# EAGLE design RscDroneBadge (EAGLE 9.6.2)
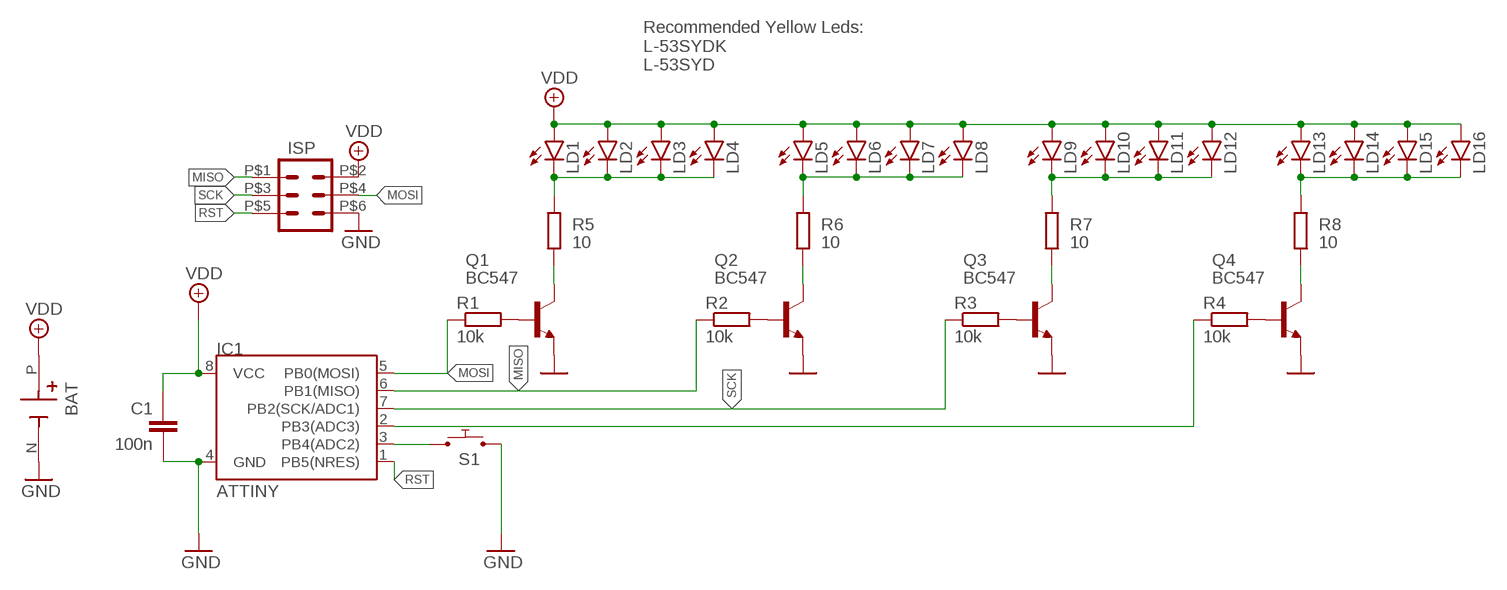
[diagram p0: schematic, sheet 1]

## Parts
BAT  CR2032 HOLDER  CR2032_PLASTIC  [CR2032_PLASTIC]
C1  100n  CAPACITOR_THT_2.54  [C_2.54]
IC1  ATTINY  ATTINY85-20PU  [DIL08]
ISP  2X3POGONO_VIA  [2X3_POGO_NO_VIA]
LD1  LED_THT-5MM_NICE  [LED_5MM_NICE]
LD2  LED_THT-5MM_NICE  [LED_5MM_NICE]
LD3  LED_THT-5MM_NICE  [LED_5MM_NICE]
LD4  LED_THT-5MM_NICE  [LED_5MM_NICE]
LD5  LED_THT-5MM_NICE  [LED_5MM_NICE]
LD6  LED_THT-5MM_NICE  [LED_5MM_NICE]
LD7  LED_THT-5MM_NICE  [LED_5MM_NICE]
LD8  LED_THT-5MM_NICE  [LED_5MM_NICE]
LD9  LED_THT-5MM_NICE  [LED_5MM_NICE]
LD10  LED_THT-5MM_NICE  [LED_5MM_NICE]
LD11  LED_THT-5MM_NICE  [LED_5MM_NICE]
LD12  LED_THT-5MM_NICE  [LED_5MM_NICE]
LD13  LED_THT-5MM_NICE  [LED_5MM_NICE]
LD14  LED_THT-5MM_NICE  [LED_5MM_NICE]
LD15  LED_THT-5MM_NICE  [LED_5MM_NICE]
LD16  LED_THT-5MM_NICE  [LED_5MM_NICE]
Q1  BC547  [TO92_ROUND]
Q2  BC547  [TO92_ROUND]
Q3  BC547  [TO92_ROUND]
Q4  BC547  [TO92_ROUND]
R1  10k  RESISTOR_0207_THT0204/7_ROUND  [RCL_0207]
R2  10k  RESISTOR_0207_THT0204/7_ROUND  [RCL_0207]
R3  10k  RESISTOR_0207_THT0204/7_ROUND  [RCL_0207]
R4  10k  RESISTOR_0207_THT0204/7_ROUND  [RCL_0207]
R5  10  RESISTOR_0207_THT0204/7_ROUND  [RCL_0207]
R6  10  RESISTOR_0207_THT0204/7_ROUND  [RCL_0207]
R7  10  RESISTOR_0207_THT0204/7_ROUND  [RCL_0207]
R8  10  RESISTOR_0207_THT0204/7_ROUND  [RCL_0207]
S1  6x6mm BUTTON  PUSH_MOMENTARY_THT_6X6MM  [TACTILE-PTH]

## Nets
GND: BAT.N(NEG) C1.2 IC1.4(GND) ISP.P$6 Q1.1(E) Q2.1(E) Q3.1(E) Q4.1(E) S1.3 S1.4
MISO: IC1.6(PB1(MISO)) ISP.P$1 R2.1
MOSI: IC1.5(PB0(MOSI)) ISP.P$4 R1.1
N$1: IC1.3(PB4(ADC2)) S1.1 S1.2
N$2: Q1.2(B) R1.2
N$3: Q2.2(B) R2.2
N$4: Q3.2(B) R3.2
N$8: Q4.2(B) R4.2
N$9: IC1.2(PB3(ADC3)) R4.1
N$10: Q1.3(C) R5.1
N$11: Q2.3(C) R6.1
N$12: Q3.3(C) R7.1
N$13: Q4.3(C) R8.1
N$14: LD9.K(C) LD10.K(C) LD11.K(C) LD12.K(C) R7.2
N$15: LD13.K(C) LD14.K(C) LD15.K(C) LD16.K(C) R8.2
N$19: LD5.K(C) LD6.K(C) LD7.K(C) LD8.K(C) R6.2
N$20: LD1.K(C) LD2.K(C) LD3.K(C) LD4.K(C) R5.2
RST: IC1.1(PB5(NRES)) ISP.P$5
SCK: IC1.7(PB2(SCK/ADC1)) ISP.P$3 R3.1
VDD: BAT.P(POS) C1.1 IC1.8(VCC) ISP.P$2 LD1.A LD2.A LD3.A LD4.A LD5.A LD6.A LD7.A LD8.A LD9.A LD10.A LD11.A LD12.A LD13.A LD14.A LD15.A LD16.A

## Notes on the sheet
- Recommended Yellow Leds:
  L-53SYDK
  L-53SYD

## Library data of the parts
BAT = BASTL_BATHOLDER:CR2032_PLASTIC: DS1092-04-B6P BH-25F-1
C1 = BASTL_CAPACITORS:CAPACITOR_THT: CAPACITOR, European symbol
IC1 = BASTL_ICS:ATTINY85: Atmel 8-pin 2/4/8kB flash uC; TYPE: THT
ISP = BASTL_CONNECTORS:2X3POGO; TYPE: POGO
LD1-LD16 = BASTL_LEDS:LED_THT: [color]_[diameter]_[difused/clear] R_3mm_D
Q1-Q4 = BASTL_TRANZISTORS:BC547
R1-R8 = BASTL_RESISTORS:RESISTOR_0207_THT: RESISTOR, European symbol
S1 = BASTL_SWITCHES:PUSH_MOMENTARY: Various NO switches- pushbuttons, reed, etc THT: TL1105SPF100Q SMT: TL3301SPF100QG, TL3301SPF160QG...; TYPE: THT

## Board
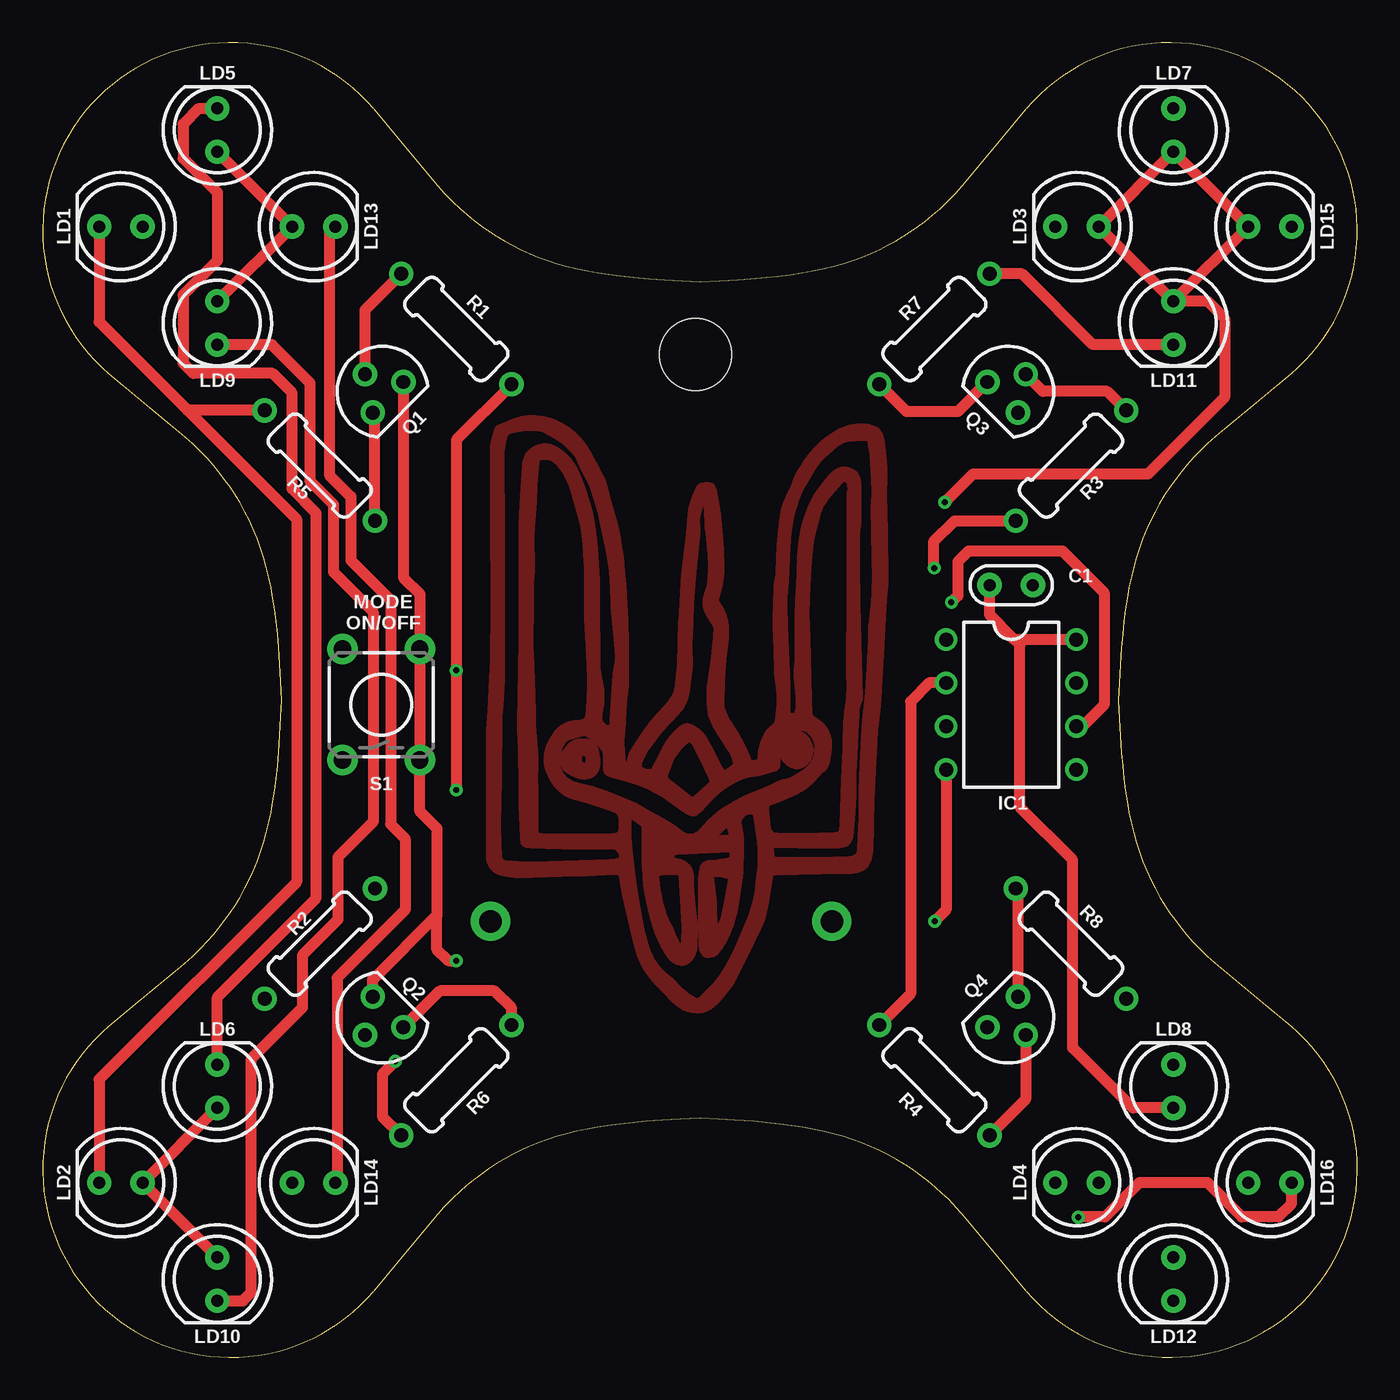
[diagram p1: board, top side]
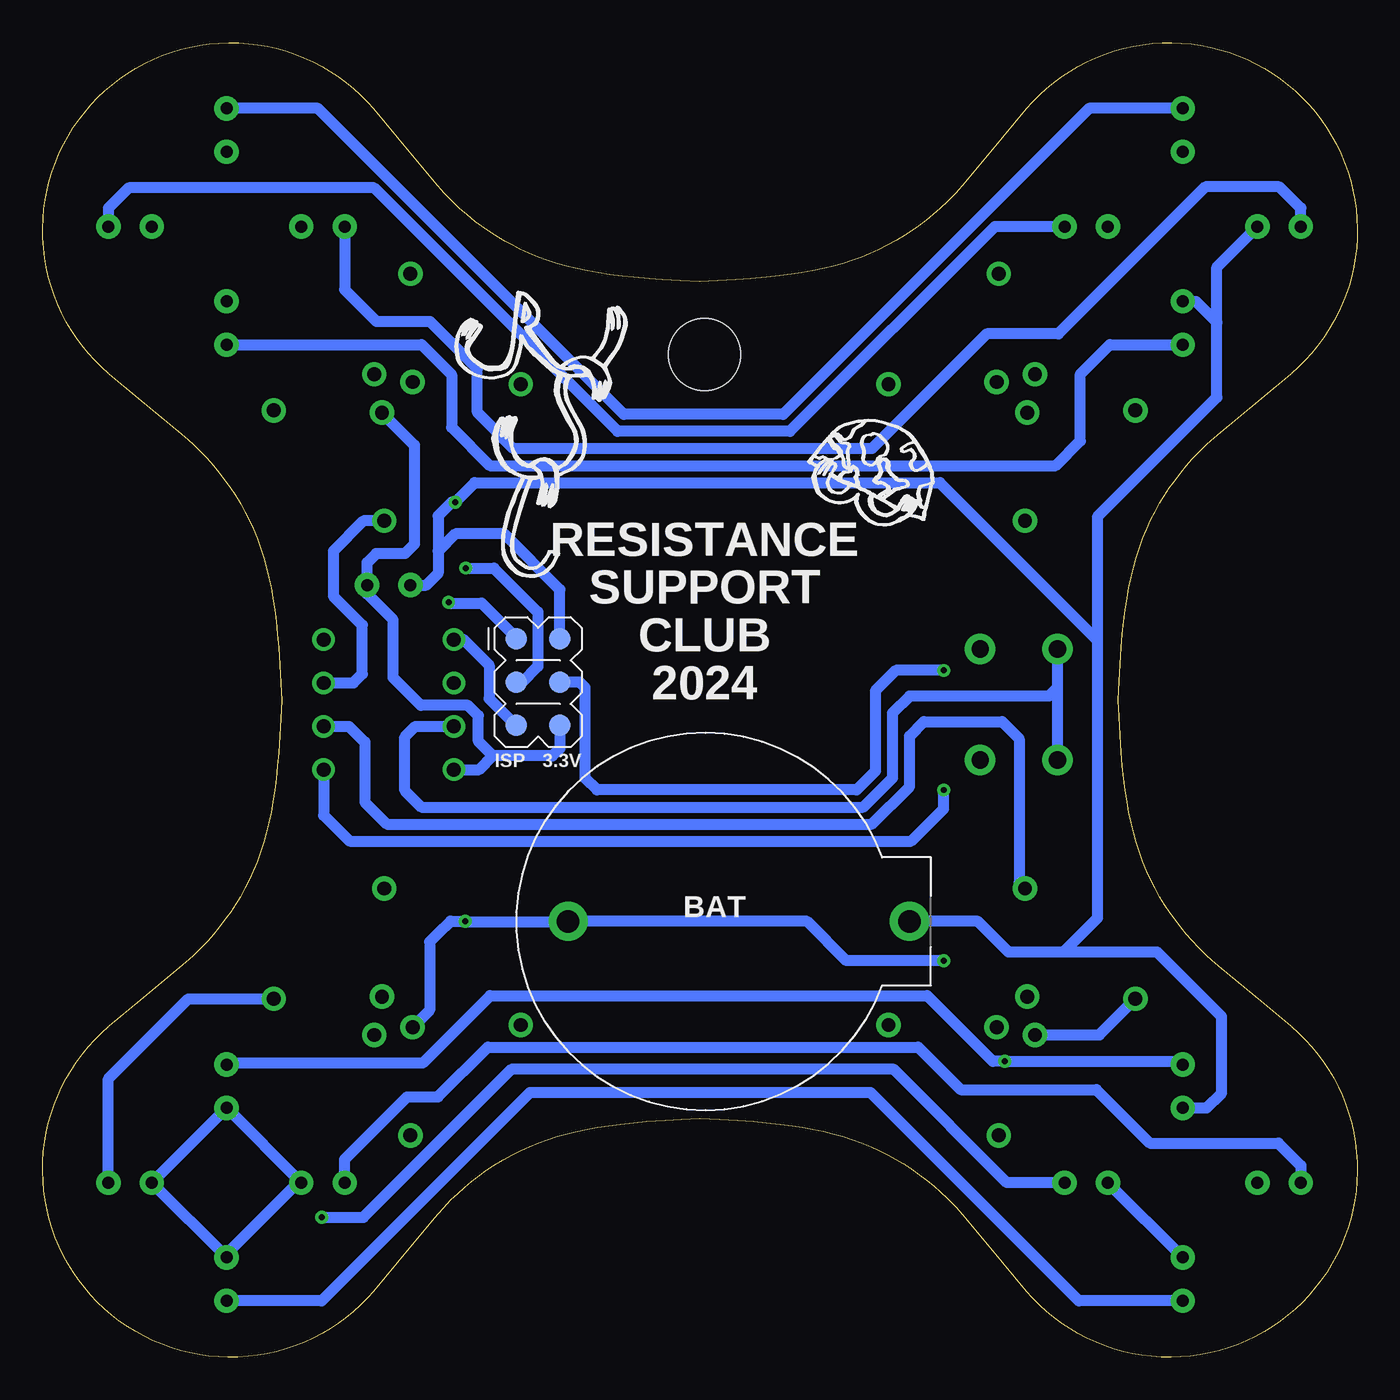
[diagram p2: board, bottom side, seen from below]

Size 77 x 77 mm. Coordinates in mm from the lower left corner, seen from the top.
Outline: 19.39,73.12 19.01,73.54 18.61,73.94 18.18,74.33 17.75,74.69 17.29,75.03 16.82,75.34 16.33,75.62 15.83,75.88 15.32,76.12 14.78,76.33 14.23,76.52 13.68,76.67 13.13,76.79 12.58,76.89 12,76.95 11.43,76.99 10.87,77 10.31,76.98 9.73,76.93 9.17,76.85 8.61,76.74 8.05,76.6 7.51,76.43 6.98,76.24 6.46,76.02 5.95,75.78 5.46,75.5 4.98,75.21 4.51,74.88 4.07,74.54 3.64,74.17 3.21,73.77 2.83,73.36 2.45,72.92 2.1,72.47 1.78,72.01 1.49,71.53 1.22,71.03 0.97,70.52 0.75,70 0.55,69.46 0.39,68.92 0.26,68.37 0.15,67.81 0.07,67.25 0.02,66.69 0,66.11 0.01,65.55 0.05,64.98 0.11,64.42 0.21,63.87 0.33,63.32 0.48,62.77 0.67,62.22 0.87,61.69 1.11,61.18 1.37,60.68 1.66,60.18 1.98,59.71 2.31,59.25 2.68,58.8 3.06,58.39 3.46,57.99 3.88,57.61 5.61,56.16 8.17,54.05 8.78,53.51 9.28,53.02 9.66,52.62 10.01,52.23 10.34,51.82 10.68,51.38 11,50.92 11.3,50.46 11.56,50.04 11.84,49.53 12.09,49.05 12.34,48.5 12.56,47.98 12.76,47.43 12.95,46.83 13.1,46.28 13.25,45.68 13.37,45.06 13.48,44.45 13.58,43.79 13.67,43.11 13.75,42.34 13.82,41.58 13.89,40.6 13.95,39.61 14,38.5 13.96,37.53 13.89,36.42 13.82,35.43 13.75,34.66 13.67,33.89 13.58,33.21 13.48,32.54 13.37,31.94 13.25,31.31 13.1,30.71 12.95,30.17 12.76,29.57 12.56,29.02 12.33,28.46 12.11,27.98 11.84,27.46 11.56,26.96 11.26,26.47 10.96,26.02 10.68,25.62 10.34,25.18 10.02,24.79 9.68,24.4 9.28,23.98 8.81,23.52 8.51,23.25 8.13,22.91 5.45,20.7 3.88,19.39 3.46,19.01 3.06,18.61 2.68,18.2 2.3,17.73 1.97,17.29 1.67,16.84 1.39,16.37 1.12,15.83 0.89,15.34 0.67,14.8 0.5,14.28 0.34,13.72 0.21,13.15 0.12,12.61 0.05,12.03 0.01,11.43 0,10.85 0.02,10.31 0.07,9.73 0.15,9.19 0.26,8.61 0.39,8.08 0.56,7.53 0.75,7 0.98,6.46 1.22,5.95 1.49,5.47 1.8,4.96 2.14,4.48 2.48,4.04 2.85,3.61 3.24,3.2 3.64,2.83 4.06,2.46 4.53,2.1 4.99,1.78 5.46,1.5 5.98,1.21 6.47,0.97 7.01,0.75 7.53,0.56 8.08,0.39 8.61,0.26 9.19,0.15 9.78,0.07 10.34,0.02 10.91,0 11.49,0.01 12.07,0.05 12.61,0.12 13.18,0.22 13.72,0.34 14.24,0.49 14.8,0.67 15.3,0.87 15.85,1.12 16.35,1.39 16.82,1.66 17.29,1.98 17.74,2.31 18.19,2.68 18.61,3.06 19.01,3.46 19.39,3.88 20.8,5.57 22.95,8.17 23.49,8.78 24.02,9.32 24.43,9.71 24.81,10.04 25.21,10.37 25.66,10.71 26.12,11.03 26.58,11.33 27.05,11.61 27.5,11.86 28.02,12.12 28.46,12.33 29.07,12.57 29.57,12.76 30.14,12.94 30.73,13.1 31.26,13.23 31.9,13.37 32.49,13.47 33.1,13.57 33.78,13.66 34.61,13.75 35.35,13.81 36.28,13.88 37.34,13.95 38.5,14 39.61,13.95 40.53,13.9 41.65,13.81 42.39,13.75 43.16,13.66 43.84,13.58 44.51,13.47 45.1,13.37 45.8,13.22 46.28,13.1 46.86,12.94 47.43,12.76 47.93,12.57 48.5,12.34 48.98,12.12 49.5,11.86 50.01,11.58 50.52,11.26 51.01,10.94 51.41,10.65 51.86,10.31 52.28,9.96 52.7,9.59 53.06,9.24 53.55,8.74 54.05,8.17 56.19,5.57 57.61,3.88 57.99,3.46 58.39,3.06 58.8,2.68 59.27,2.3 59.71,1.97 60.16,1.67 60.65,1.38 61.16,1.12 61.66,0.89 62.2,0.67 62.72,0.5 63.28,0.34 63.85,0.21 64.39,0.12 64.97,0.05 65.56,0.01 66.15,0 66.69,0.02 67.27,0.07 67.81,0.15 68.39,0.26 68.92,0.39 69.47,0.56 70,0.75 70.54,0.98 71.05,1.22 71.53,1.49 72.02,1.79 72.5,2.13 72.95,2.47 73.39,2.85 73.8,3.24 74.17,3.64 74.54,4.06 74.9,4.53 75.22,4.99 75.5,5.46 75.79,5.98 76.03,6.47 76.25,7.01 76.44,7.53 76.61,8.08 76.74,8.61 76.85,9.19 76.93,9.76 76.98,10.32 77,10.89 76.99,11.49 76.95,12.03 76.88,12.61 76.78,13.18 76.66,13.72 76.51,14.26 76.33,14.8 76.13,15.3 75.88,15.85 75.61,16.35 75.33,16.82 75.02,17.29 74.69,17.74 74.32,18.19 73.94,18.61 73.54,19.01 73.12,19.39 71.29,20.92 68.83,22.95 68.21,23.5 67.72,23.98 67.34,24.38 66.98,24.79 66.66,25.18 66.32,25.62 66,26.08 65.7,26.53 65.44,26.96 65.16,27.46 64.89,27.98 64.66,28.5 64.44,29.02 64.24,29.57 64.05,30.17 63.9,30.71 63.75,31.31 63.62,31.94 63.52,32.54 63.42,33.21 63.33,33.89 63.25,34.66 63.18,35.42 63.11,36.4 63.05,37.39 63,38.5 63.04,39.47 63.1,40.56 63.18,41.55 63.25,42.34 63.33,43.11 63.41,43.79 63.52,44.45 63.62,45.06 63.75,45.67 63.9,46.28 64.05,46.83 64.24,47.43 64.44,47.98 64.67,48.53 64.89,49.02 65.16,49.53 65.4,49.98 65.73,50.52 66.04,50.98 66.32,51.38 66.65,51.82 67.01,52.25 67.39,52.68 67.72,53.02 68.18,53.48 68.48,53.75 68.87,54.08 71.39,56.16 73.12,57.61 73.54,57.99 73.94,58.39 74.32,58.8 74.7,59.27 75.02,59.71 75.33,60.16 75.61,60.63 75.88,61.16 76.12,61.68 76.33,62.2 76.5,62.72 76.66,63.28 76.79,63.85 76.88,64.39 76.95,64.97 76.99,65.56 77,66.15 76.98,66.69 76.93,67.27 76.85,67.81 76.74,68.38 76.61,68.92 76.44,69.47 76.25,70 76.02,70.54 75.77,71.05 75.51,71.53 75.2,72.04 74.86,72.51 74.52,72.96 74.15,73.39 73.76,73.8 73.36,74.17 72.93,74.54 72.47,74.9 72.01,75.22 71.54,75.5 71.02,75.79 70.52,76.03 69.99,76.25 69.47,76.44 68.92,76.61 68.38,76.74 67.81,76.85 67.24,76.93 66.69,76.98 66.11,77 65.51,76.99 64.93,76.95 64.39,76.88 63.81,76.78 63.28,76.66 62.75,76.51 62.2,76.33 61.69,76.13 61.15,75.88 60.65,75.61 60.18,75.34 59.71,75.02 59.25,74.69 58.8,74.32 58.39,73.94 57.99,73.54 57.61,73.12 56.19,71.43 54.05,68.83 53.48,68.18 52.98,67.68 52.56,67.28 52.13,66.91 51.65,66.52 51.27,66.24 50.82,65.93 50.39,65.65 49.94,65.38 49.47,65.12 49.05,64.91 48.53,64.67 47.98,64.44 47.47,64.25 46.86,64.06 46.32,63.91 45.8,63.78 45.1,63.63 44.45,63.52 43.79,63.42 43.06,63.32 42.39,63.25 41.48,63.17 40.7,63.11 39.66,63.05 38.5,63 37.46,63.05 36.4,63.11 35.52,63.17 34.61,63.25 33.84,63.33 33.15,63.42 32.54,63.52 31.9,63.63 31.19,63.78 30.68,63.91 30.14,64.06 29.57,64.24 29.04,64.44 28.55,64.64 28.03,64.87 27.53,65.12 27.03,65.4 26.61,65.65 26.18,65.93 25.73,66.24 25.25,66.6 24.87,66.91 24.43,67.29 24,67.69 23.52,68.18 22.95,68.83 20.8,71.43 19.39,73.12
Copper layers (1*16): Top 0.035mm / dielectric 1.5mm / Bottom 0.035mm
Design rules "default_tenting_vias": minimum track width 6mil, minimum drill 0.35mm, track to track 6mil, track to pad 6mil, pad to pad 6mil, via to via 6mil, smd to smd 6mil, copper to edge 20mil, drill to drill 6mil, minimum pad ring 10mil, minimum via ring 8mil, stop-mask expansion 4mil, vias tented up to drill 15mil, thermal gap 10mil
Holes 4.2 mm at 38.23,58.73

### Footprints (pad centres in the part's own frame; a part is rotated, then mirrored left to right if it is on the bottom)
CR2032_PLASTIC = drill 1.3 pad 2.286: N -8,0; P 12,0
C_2.54 = drill 0.7 pad 1.422: 1 -1.27,0; 2 1.27,0
DIL08 = drill 0.813 pad 1.27: 1 -3.81,-3.81; 2 -1.27,-3.81; 3 1.27,-3.81; 4 3.81,-3.81; 5 3.81,3.81; 6 1.27,3.81; 7 -1.27,3.81; 8 -3.81,3.81
2X3_POGO_NO_VIA = smd 1.27 x 1.27: P$1 0,0; P$2 0,2.54; P$3 2.54,0; P$4 2.54,2.54; P$5 5.08,0; P$6 5.08,2.54
LED_5MM_NICE = drill 0.7 pad 1.422: A -1.27,0; K 1.27,0
TO92_ROUND = drill 0.813 pad 1.422: 1 1.27,0; 2 0,1.905; 3 -1.27,0
RCL_0207 = drill 0.813 pad 1.422: 1 -4.572,0; 2 4.572,0
TACTILE-PTH = drill 1.016 pad 1.778: 1 -3.251,2.261; 2 3.251,2.261; 3 -3.251,-2.261; 4 3.251,-2.261

### Placement (x,y rotation side)
BAT  38.23,25.53 0 bottom
C1  56.73,45.23 0 top
IC1  56.73,38.23 270 top
ISP  49.25,42.09 270 bottom
LD1  4.58,66.23 180 top
LD2  4.58,10.23 180 top
LD3  60.58,66.23 180 top
LD4  60.58,10.23 180 top
LD5  10.23,71.88 90 top
LD6  10.23,15.88 90 top
LD7  66.23,71.88 90 top
LD8  66.23,15.88 90 top
LD9  10.23,60.58 270 top
LD10  10.23,4.58 270 top
LD11  66.23,60.58 270 top
LD12  66.23,4.58 270 top
LD13  15.88,66.23 0 top
LD14  15.88,10.23 0 top
LD15  71.88,66.23 0 top
LD16  71.88,10.23 0 top
Q1  20.23,56.23 45 top
Q2  20.23,20.23 135 top
Q3  56.23,56.23 315 top
Q4  56.23,20.23 225 top
R1  24.23,60.23 135 top
R2  16.23,24.23 225 top
R3  60.23,52.23 45 top
R4  52.23,16.23 315 top
R5  16.23,52.23 135 top
R6  24.23,16.23 225 top
R7  52.23,60.23 45 top
R8  60.23,24.23 315 top
S1  19.83,38.23 90 top

### Tracks (layer width: path | path; a pad name or v marks a point on that pad's centre or on a via)
GND  (via drill 0.35)
  Top 0.635: Q1.1 21.13,45.67 22.09,44.71 S1.4 S1.3 22.09,31.98 23.09,30.98 23.09,25.89 | Q2.1 19.33,22.13 23.09,25.89 | v24.23,23.23 23.75,23.23 23.09,23.89 23.09,25.89 | IC1.4 52.92,26.22 v52.25,25.55
  Bottom 0.635: Q3.1 55.23,53.43 55.23,47.63 55.79,47.07 57.47,47.07 58,46.54 C1.2 58,44.72 56.47,43.19 56.47,39.81 54.85,38.19 52.09,38.19 51.48,37.58 51.48,36.08 50.63,35.23 | v24.23,23.23 29.93,23.23 32.23,25.53 BAT.N 52.22,25.52 v52.25,25.55 53.11,25.55 53.83,24.83 54.33,24.33 54.33,20.33 Q4.1 | ISP.P$6 46.71,35.66 47.14,35.23 50.63,35.23 | IC1.4 51.44,34.42 50.63,35.23
GND1
  pour Top (rank 3): 49.48,48.42 49.45,50.52 49.48,51.61 49.47,52.09 49.41,52.79 49.33,53.58 49.27,53.86 49.19,54.07 49.12,54.19 49.05,54.29 48.96,54.38 48.84,54.46 48.72,54.53 48.59,54.58 48.43,54.61 48.24,54.64 48.05,54.66 47.84,54.66 47.64,54.65 47.45,54.62 47.26,54.58 47.06,54.52 46.86,54.45 46.68,54.37 46.43,54.24 46.16,54.08 45.9,53.89 45.64,53.68 45.39,53.46 45.16,53.22 44.94,52.96 44.74,52.7 44.56,52.45 44.4,52.2 44.2,51.89 44.09,51.69 44,51.48 43.75,50.86 44.49,50.69 44.69,51.08 45.32,52.12 45.44,52.3 45.58,52.48 45.77,52.68 46,52.91 46.27,53.14 46.57,53.38 46.73,53.49 46.89,53.57 47.03,53.63 47.19,53.66 47.3,53.67 47.59,53.67 48.16,53.73 48.24,53.73 48.28,53.72 48.31,53.68 48.33,53.61 48.37,53.35 48.44,52.91 48.51,51.86 48.55,50.78 48.55,50.59 48.52,50.1 48.51,49.83 48.56,46.83 48.57,45.67 48.57,45.05 48.56,44.75 48.53,44.33 48.46,43.73 48.46,43.72 48.4,43.19 48.37,42.84 48.35,41.96 48.21,39.35 48.17,38.91 48.01,37.31 47.95,36.49 47.91,35.8 47.86,34.71 47.81,33.12 47.8,32.68 47.8,31.94 47.8,31.61 47.72,29.83 47.71,29.69 47.68,29.58 47.65,29.52 47.62,29.48 47.58,29.44 47.52,29.4 47.41,29.36 47.23,29.33 46.3,29.29 43.02,29.27 42.92,29.29 42.88,29.32 42.86,29.37 42.82,29.72 42.81,29.86 43,29.87 44.24,29.86 46.42,29.85 46.65,29.86 46.81,29.87 46.95,29.9 47.07,29.94 47.17,30 47.25,30.07 47.33,30.15 47.39,30.25 47.44,30.37 47.47,30.5 47.59,31.89 47.65,32.91 47.66,33.33 47.66,34.29 47.67,34.66 47.7,35.24 47.78,36.59 47.81,37.67 47.83,37.88 47.87,38.05 47.92,38.24 48.01,38.45 48.03,38.52 48.03,38.61 47.89,44.11 47.85,46.42 47.85,47.92 47.87,48.15 47.92,48.71 47.94,48.96 47.94,51.21 47.92,51.35 47.9,51.47 47.85,51.59 47.79,51.7 47.72,51.8 47.63,51.88 47.54,51.96 47.41,52.03 47.22,52.1 47.11,52.13 47.01,52.14 46.9,52.14 46.81,52.13 46.71,52.11 46.61,52.07 46.45,51.99 46.31,51.89 46.08,51.65 45.84,51.39 45.59,51.09 45.36,50.78 45.17,50.48 45,50.17 44.81,49.79 44.68,49.47 44.55,49.06 44.44,48.65 44.37,48.34 44.31,48 44.26,47.65 44.22,47.3 44.19,46.86 44.16,45.85 44.07,44.27 44.05,43.46 44.06,41.96 44.05,41.32 44.04,40.83 44,40.16 43.99,39.95 44.01,39.56 44.1,38.68 44.12,38.33 44.1,38.05 44.05,37.77 44.04,37.74 44.01,37.71 43.98,37.7 43.93,37.69 43.86,37.69 43.79,37.7 43.78,37.71 43.78,37.74 43.77,39.42 43.64,42.75 43.6,44.14 43.62,44.51 43.7,45.42 43.78,47.43 43.81,47.86 43.85,48.26 43.93,48.8 44.03,49.32 44.15,49.8 44.31,50.25 44.49,50.69 43.75,50.86 43.68,50.71 43.54,50.47 43.45,50.28 43.36,50.05 43.29,49.81 43.23,49.53 43.17,49.2 43.07,48.45 43.04,48.15 43,47.52 42.94,46.02 42.93,45.85 42.86,45.43 42.83,45.22 42.78,44.09 42.77,43.44 42.77,42.77 42.79,42.2 42.83,41.36 42.84,40.26 42.86,40 42.88,39.77 42.98,39.15 43,38.78 43,38.51 42.98,38.21 42.91,37.39 42.87,37.23 42.84,37.15 42.8,37.09 42.77,37.05 42.55,36.87 42.38,36.69 42.23,36.47 42.11,36.24 42.02,36.01 41.96,35.75 41.92,35.51 41.89,35.12 41.86,35 41.84,34.97 41.79,34.96 41.54,34.94 41.53,34.94 41.5,34.97 41.4,35.25 41.3,35.5 41.18,35.77 41.03,36.05 40.8,36.47 40.23,37.38 40.12,37.58 40.05,37.72 39.99,37.87 39.96,38.01 39.93,38.15 39.92,38.36 39.96,39.45 39.98,40.1 40.05,40.93 40.17,42.07 40.19,42.37 40.19,42.63 40.17,42.86 40.14,43.07 40.1,43.28 40.04,43.48 39.96,43.68 39.88,43.85 39.78,44.02 39.64,44.22 39.62,44.27 39.61,44.34 39.61,44.41 39.63,44.5 39.78,45.01 39.83,45.25 39.87,45.49 39.9,45.74 39.92,45.96 39.93,46.21 39.93,46.46 39.9,47.16 39.86,47.81 39.82,48.43 39.76,49.1 39.72,49.43 39.66,49.8 39.48,50.77 39.43,50.94 39.36,51.06 39.31,51.11 39.25,51.15 39.14,51.2 39,51.22 38.77,51.21 38.65,51.2 38.5,51.15 38.42,51.11 38.37,51.07 38.3,50.99 38.24,50.9 38.04,50.43 37.94,50.16 37.89,49.98 37.84,49.81 37.78,49.39 38.52,49.23 38.55,49.42 38.71,49.98 38.77,48.94 38.79,48.62 38.78,48.6 38.83,48.28 38.95,47.02 38.98,46.47 38.98,46.09 38.97,45.7 38.92,45.35 38.88,45.16 38.84,44.99 38.79,44.82 38.71,44.61 38.68,44.5 38.65,44.33 38.65,44.15 38.67,44.03 38.69,43.91 38.73,43.78 38.79,43.64 38.93,43.36 39.23,42.9 39.28,42.79 39.3,42.69 39.29,42.19 39.23,41.6 39.16,41.04 38.97,39.8 38.91,39.22 38.89,38.9 38.88,38.59 38.89,38.3 38.91,38.01 38.94,37.8 38.99,37.59 39.06,37.37 39.15,37.16 39.26,36.96 39.39,36.73 39.96,35.85 40.17,35.49 40.29,35.25 40.38,35.02 40.43,34.85 40.43,34.8 40.43,34.75 40.4,34.68 40.35,34.63 40.12,34.47 39.94,34.37 39.9,34.42 39.84,34.51 39.12,35.89 38.89,36.29 38.78,36.45 38.68,36.57 38.55,36.69 37.96,35.99 38.01,35.94 38.08,35.82 38.45,35.1 39.02,33.92 39.07,33.74 39.07,33.73 39.03,33.65 39.61,33.03 39.79,33.18 40.07,33.39 40.3,33.54 40.52,33.67 40.85,33.83 41.17,33.94 41.42,34 41.84,34.07 42.13,34.13 42.61,34.27 42.95,34.37 43.01,34.4 43.06,34.44 43.12,34.51 43.16,34.59 43.19,34.69 43.21,34.83 43.2,35.17 43.27,35.05 43.34,34.95 43.42,34.85 43.51,34.77 43.6,34.69 43.71,34.62 43.82,34.56 43.91,34.52 44.02,34.49 44.1,34.48 44.19,34.48 44.3,34.49 44.4,34.51 44.5,34.55 44.59,34.6 44.68,34.66 44.78,34.74 44.86,34.82 44.95,34.94 45.01,35.04 45.06,35.15 45.11,35.29 45.14,35.41 45.15,35.55 45.15,35.64 45.14,35.74 45.11,35.84 45.07,35.94 45.02,36.05 44.96,36.16 44.89,36.26 44.81,36.36 44.72,36.44 44.64,36.51 44.55,36.57 44.47,36.61 44.39,36.64 44.3,36.66 44.13,36.65 44.03,36.62 43.93,36.59 43.81,36.53 43.71,36.47 43.52,36.31 43.42,36.21 43.34,36.12 43.47,36.29 43.56,36.38 43.64,36.45 43.83,36.57 44.04,36.66 44.16,36.69 44.26,36.71 44.39,36.72 44.49,36.72 44.65,36.68 44.73,36.64 44.8,36.59 44.88,36.52 44.95,36.44 45.02,36.34 45.08,36.24 45.14,36.13 45.17,36.03 45.2,35.92 45.21,35.82 45.21,35.64 45.2,35.48 45.18,35.33 45.14,35.19 45.1,35.06 45.04,34.93 44.97,34.81 44.89,34.69 45.57,34.16 45.65,34.26 45.78,34.34 45.89,34.43 45.95,34.51 46.02,34.62 46.06,34.74 46.09,34.85 46.19,35.45 46.21,35.64 46.22,35.83 46.22,36.01 46.2,36.18 46.17,36.34 46.13,36.49 46.07,36.62 46.01,36.75 45.93,36.87 45.84,36.98 45.72,37.11 45.59,37.22 45.42,37.35 45.21,37.48 45.16,37.52 45.1,37.61 45.07,37.73 45.06,38.56 44.96,42.14 44.91,43.58 44.92,44.38 44.95,45.2 45.05,46.66 45.11,47.28 45.16,47.73 45.2,47.94 45.25,48.18 45.39,48.77 45.45,48.93 45.5,49.21 45.56,49.43 45.65,49.65 45.76,49.87 45.9,50.09 46.05,50.31 46.6,50.97 46.76,51.16 46.84,51.23 46.9,51.27 46.96,51.3 47.01,51.3 47.04,51.29 47.07,51.26 47.11,51.17 47.14,51.04 47.15,50.89 47.14,50.71 47.09,50.71 47.09,44.69 47.08,40.23 47.08,39.14 47.07,38.87 47.06,38.61 46.94,37.79 46.89,37.17 46.88,36.84 46.87,36.2 46.86,35.64 46.77,33.84 46.68,31.18 46.65,30.91 46.62,30.82 46.57,30.76 46.49,30.73 46.38,30.71 44.59,30.68 43.32,30.66 43.17,30.67 43.02,30.68 42.91,30.7 42.83,30.74 42.76,30.79 42.71,30.84 42.68,30.92 42.65,31.02 42.63,31.18 42.63,31.19 42.53,32.17 42.54,32.26 42.55,32.29 42.57,32.32 42.64,32.36 42.91,32.45 43.19,32.56 44.14,32.99 44.45,33.15 44.69,33.3 44.87,33.44 45.06,33.62 45.57,34.16 44.89,34.69 44.76,34.57 44.63,34.46 44.08,34.09 43.89,33.98 43.76,33.92 43.64,33.88 43.54,33.86 43.35,33.83 43.19,33.78 43.03,33.71 42.65,33.49 42.03,33.24 42,33.23 41.43,33 41.03,32.82 40.53,32.56 40.1,32.31 39.84,32.15 39.63,32 39.42,31.84 39.24,31.7 38.98,31.46 38.51,30.93 38.39,30.82 38.31,30.76 38.19,30.69 38.05,30.65 37.91,30.64 37.77,30.65 37.64,30.69 37.51,30.75 37.03,31.14 36.77,31.32 36.34,31.56 35.38,32.06 34.95,32.33 34.78,32.42 33.54,32.94 33,33.15 32.56,33.32 32.25,33.41 31.48,33.59 31.17,33.68 31.03,33.74 30.89,33.81 30.77,33.9 30.67,33.99 30.6,34.07 30.52,34.16 30.42,34.35 30.38,34.45 30.34,34.57 30.31,34.79 30.36,34.65 30.44,34.51 30.54,34.39 30.66,34.28 30.8,34.18 30.96,34.09 31.23,33.98 31.4,33.92 31.55,33.89 31.71,33.87 31.87,33.88 32.01,33.91 32.14,33.95 32.26,34.02 32.36,34.1 32.46,34.2 32.52,34.29 32.56,34.39 32.6,34.48 32.63,34.59 32.65,34.69 32.66,34.81 32.66,35.06 32.64,35.18 32.6,35.34 31.79,35.13 31.8,35.04 31.8,34.85 31.79,34.81 31.78,34.8 31.71,34.8 31.66,34.81 31.63,34.83 31.6,34.87 31.58,34.94 31.57,35.01 31.57,35.15 31.58,35.24 31.59,35.25 31.64,35.26 31.71,35.25 31.75,35.24 31.78,35.2 31.79,35.13 32.6,35.34 32.57,35.55 32.52,35.73 32.47,35.84 32.41,35.93 32.33,36.01 32.25,36.07 32.17,36.11 32.07,36.15 31.97,36.17 31.86,36.19 31.65,36.19 31.44,36.21 31.32,36.2 31.2,36.17 31.12,36.14 31.02,36.09 30.85,35.97 30.75,35.87 30.66,35.77 30.36,35.38 30.37,35.45 30.42,35.59 30.56,35.91 30.64,36.04 30.73,36.13 30.81,36.17 30.89,36.2 31.72,36.43 31.76,36.43 32.2,36.13 32.4,35.97 32.5,35.87 32.6,35.76 32.7,35.62 32.76,35.53 32.81,35.42 32.83,35.26 32.82,34.63 32.84,34.4 32.86,34.31 32.89,34.23 32.94,34.17 32.99,34.13 33.1,34.07 33.24,34.01 34.21,33.74 34.77,33.57 35.17,33.42 35.51,33.28 35.88,33.08 36.3,32.82 36.67,32.58 37.49,31.99 37.72,31.83 37.83,31.78 37.93,31.74 38.03,31.71 38.12,31.71 38.19,31.73 38.27,31.76 38.35,31.8 38.43,31.86 38.58,31.99 39.26,32.71 39.61,33.03 39.03,33.65 38.95,33.58 38.11,32.8 38.08,32.78 38.07,32.78 38.01,32.81 36.91,33.67 36.75,33.81 36.62,33.93 36.6,33.99 36.6,34.08 36.87,34.77 36.98,35 37.08,35.2 37.22,35.41 37.38,35.61 37.6,35.84 37.84,36.05 37.86,36.06 37.89,36.05 37.96,35.99 38.55,36.69 38.4,36.81 38.23,36.93 38.08,37.03 38,37.06 37.9,37.09 37.79,37.1 37.69,37.1 37.57,37.07 37.44,37.01 37.32,36.93 37.18,36.82 37.01,36.67 36.87,36.51 36.72,36.34 36.49,36.03 36.28,35.68 36.1,35.35 35.84,34.81 35.71,34.56 35.64,34.42 35.63,34.41 35.52,34.4 35.39,34.43 35.25,34.47 35.14,34.53 35.1,34.56 35.08,34.61 35.08,34.7 35.09,34.78 35.09,34.8 35.2,35.06 35.34,35.33 35.5,35.6 35.69,35.88 35.87,36.12 36.07,36.37 36.62,37.03 36.79,37.21 37.24,37.66 37.46,37.91 37.58,38.09 37.67,38.26 37.75,38.43 37.81,38.62 37.89,39.05 37.97,39.54 38.02,39.98 38.07,40.45 38.08,40.81 38.05,41.46 38.05,41.72 38.09,43.1 38.13,44.07 38.18,44.91 38.24,45.67 38.51,48.33 38.52,48.58 38.49,48.9 38.5,49.07 38.52,49.23 37.78,49.39 37.69,48.28 37.49,46.55 37.42,45.83 37.35,44.8 37.27,43.64 37.24,43.04 37.16,40.58 37.07,39.84 37.05,39.38 37.01,39.14 36.95,38.97 36.88,38.79 36.78,38.62 36.67,38.45 36.49,38.23 35.97,37.67 35.62,37.26 35.32,36.88 34.99,36.4 34.71,35.96 34.33,35.34 34.29,35.24 34.26,35.14 34.21,34.85 34.19,34.81 34.16,34.8 34.09,35.57 34.07,35.91 34.06,36.15 34.12,36.73 34.21,38.33 34.31,39.32 34.33,40.73 34.32,41.89 34.29,43.11 34.25,44.11 34.17,45.24 34.1,46.07 34.02,46.85 33.93,47.54 33.81,48.16 33.73,48.56 33.65,48.9 33.3,50.12 33.07,51.03 33.01,51.23 32.95,51.42 32.82,51.7 32.56,52.15 32.13,52.96 31.9,53.33 31.65,53.66 31.51,53.83 31.35,54 31.18,54.16 31.01,54.3 30.84,54.43 30.65,54.56 30.45,54.68 30.25,54.78 30.04,54.87 29.81,54.96 29.57,55.03 29.35,55.08 29.12,55.12 28.89,55.14 28.65,55.15 28.42,55.14 28.22,55.12 28.02,55.08 27.81,55.03 27.61,54.96 27.38,54.88 27.12,54.77 27.37,54.12 27.47,54.15 28.15,54.26 28.47,54.29 28.75,54.3 29.01,54.28 29.22,54.23 29.4,54.16 30,53.82 30.26,53.67 30.51,53.48 30.74,53.28 30.94,53.06 31.12,52.82 31.23,52.66 31.32,52.49 31.56,51.96 31.97,51.14 32.09,50.84 32.25,50.36 32.4,49.89 32.53,49.37 32.7,48.65 32.87,47.84 33,47.17 33.1,46.57 33.17,46.03 33.22,45.51 33.25,45.03 33.27,44.27 33.28,43.92 33.47,41.79 33.52,40.98 33.51,40.72 33.43,40.21 33.4,40 33.22,37.33 33.22,37.14 33.18,37 33.15,37 33.08,37.01 33.01,37.03 32.95,37.07 32.89,37.13 32.84,37.2 32.81,37.26 32.78,37.35 32.77,37.44 32.77,37.54 32.78,37.65 32.84,38.01 32.88,38.29 32.89,38.54 32.89,38.78 32.88,39.08 32.84,39.38 32.78,39.73 32.68,40.16 32.65,40.44 31.87,40.49 31.89,39.89 31.88,39.22 31.86,38.52 31.81,37.69 31.79,37.55 31.76,37.47 31.71,37.39 31.67,37.37 31.62,37.35 31.5,37.32 31.15,37.29 30.95,37.25 30.74,37.19 30.54,37.1 30.35,36.98 30.17,36.83 30,36.66 29.83,36.45 29.66,36.17 29.52,35.9 29.43,35.63 29.37,35.36 29.34,35.07 29.36,34.81 29.41,34.53 29.5,34.27 29.51,34.24 29.61,34.02 29.72,33.81 29.84,33.62 29.96,33.45 30.1,33.29 30.24,33.15 30.39,33.03 30.56,32.93 30.73,32.84 30.93,32.76 31.97,32.45 33.13,32.08 33.45,31.96 33.54,31.92 33.6,31.88 33.66,31.81 33.7,31.75 33.72,31.67 33.74,31.54 34.48,31.53 34.52,31.51 34.62,31.46 34.84,31.32 35.06,31.14 35.07,31.13 35.08,31.09 35.09,30.86 35.09,29.52 35.1,28.92 35.14,28.24 35.19,27.62 35.25,27.13 35.34,26.68 35.56,25.81 35.71,25.3 35.86,24.85 36.02,24.46 36.19,24.13 36.43,23.7 36.59,23.47 36.74,23.29 36.91,23.14 37.02,23.07 37.09,23.03 37.24,22.98 37.38,22.96 37.52,22.97 37.66,23 37.8,23.07 37.93,23.17 38.04,23.28 38.14,23.42 38.21,23.55 38.26,23.66 38.3,23.8 38.33,23.93 38.35,24.18 38.36,24.8 38.39,25.11 38.25,26.25 38.18,26.88 37.35,26.78 37.43,25.2 37.43,25.18 37.39,24.37 37.38,24.21 37.37,24.16 37.09,24.73 36.93,25.14 36.77,25.43 36.65,25.69 36.53,25.98 36.43,26.3 36.33,26.66 36.25,27.02 36.19,27.42 36.1,28.02 36.09,28.12 36.1,28.19 36.12,28.22 36.16,28.25 36.27,28.27 36.44,28.29 37.13,28.31 37.2,28.3 37.23,28.26 37.24,28.17 37.35,26.78 38.18,26.88 38.14,27.67 38.14,28.01 38.13,28.17 38.09,28.39 38.04,28.58 37.97,28.72 37.87,28.85 37.75,28.95 37.6,29.05 37.39,29.13 37.14,29.21 36.93,29.25 36.81,29.26 36.68,29.26 36.68,29.27 36.82,29.28 36.92,29.3 36.99,29.35 37.06,29.45 37.09,29.47 37.13,29.48 40.25,29.62 40.24,29.36 40.23,29.29 40.2,29.26 40.02,29.21 39.76,29.16 39.3,29.09 38.95,29.07 38.81,29.04 38.69,28.97 38.6,28.89 38.53,28.77 38.48,28.63 38.43,28.3 38.4,28.04 38.41,26.15 38.43,24.09 38.44,23.98 38.47,23.88 38.52,23.77 38.58,23.66 38.64,23.58 38.72,23.5 38.79,23.45 38.86,23.43 38.98,23.42 39.1,23.42 39.24,23.45 39.36,23.49 39.43,23.54 39.5,23.59 39.68,23.81 39.82,23.99 39.95,24.18 40.06,24.38 40.18,24.6 40.28,24.82 40.37,25.05 40.47,25.32 40.55,25.57 40.68,26.05 40.78,26.56 40.95,27.75 40.15,27.98 40.09,27.65 39.92,26.68 39.75,25.83 39.71,25.71 39.67,25.6 39.52,25.28 39.49,26.31 39.49,26.53 39.48,26.68 39.48,26.69 39.39,27.41 39.29,28.18 39.73,28.14 39.98,28.1 40.13,28.07 40.15,27.98 40.95,27.75 40.99,28.08 41.02,28.45 41.04,28.88 41.05,29.33 41.05,30.46 41.03,30.69 40.18,30.63 40.17,30.58 40.13,30.57 40.07,30.55 39.96,30.55 39.82,30.57 39.52,30.53 39.53,30.54 39.83,30.83 40.08,31.05 40.11,30.99 40.12,30.87 40.17,30.7 40.18,30.63 41.03,30.69 40.93,31.19 40.92,31.3 40.93,31.39 40.95,31.46 40.98,31.54 41.02,31.61 41.08,31.68 41.14,31.74 41.22,31.79 41.3,31.82 41.39,31.84 41.47,31.84 41.54,31.83 41.58,31.79 41.61,31.75 41.77,30.76 41.84,30.18 41.89,29.69 41.9,29.26 41.87,28.77 41.81,28.12 41.81,28.11 41.74,27.5 41.68,27.09 41.59,26.68 41.48,26.29 41.35,25.93 40.92,24.88 40.65,24.25 40.38,23.67 40.16,23.23 39.92,22.8 39.67,22.41 39.44,22.08 39.27,21.88 39.08,21.67 38.43,21.02 38.38,21 38.31,21 37.95,21.21 37.79,21.32 37.65,21.43 37.44,21.62 36.89,22.17 36.48,22.51 36.29,22.69 36.07,22.94 35.88,23.22 35.72,23.51 35.59,23.84 35.47,24.19 35.37,24.55 35.27,24.94 35.18,25.35 34.99,26.36 34.77,27.77 34.61,28.98 34.52,29.75 34.49,30.49 34.48,31.53 33.74,31.54 33.74,31.3 33.74,30.94 33.72,30.82 33.69,30.74 33.65,30.71 33.58,30.68 33.39,30.67 29.46,30.64 29.26,30.66 29.12,30.67 29.06,30.7 29.04,30.73 29.03,30.78 29.02,30.89 29.01,33.23 28.99,33.83 29.01,34.76 29.01,35.15 28.99,35.56 28.93,36.31 28.89,37.02 28.87,37.76 28.83,39.66 28.75,41.14 28.73,41.62 28.73,42.36 28.75,43.56 28.76,44.92 28.77,45.34 28.81,46.04 28.82,46.34 28.82,46.82 28.8,47.56 28.8,48.09 28.83,48.65 28.93,50.11 28.96,51 28.99,51.52 29.04,52.12 29.08,52.4 29.1,52.5 29.12,52.55 29.16,52.59 29.23,52.61 29.32,52.62 29.51,52.61 29.66,52.58 29.81,52.51 29.94,52.43 30.08,52.29 30.24,52.1 30.39,51.89 30.54,51.65 30.64,51.44 30.74,51.22 30.83,50.99 30.92,50.72 31.42,48.97 31.51,48.58 31.58,48.16 31.63,47.63 31.67,47.03 31.71,46.21 31.73,45.78 31.73,45.31 31.71,43.93 31.72,43.3 31.71,43.29 31.71,43.27 31.84,41.14 31.87,40.49 32.65,40.44 32.64,44.48 32.62,45.52 32.58,46.42 32.52,47.4 32.43,48.25 32.37,48.65 32.31,49.01 32.24,49.36 32.15,49.72 32.02,50.18 31.87,50.66 31.69,51.16 31.45,51.77 31.33,52.01 31.2,52.24 31.06,52.46 30.89,52.67 30.67,52.9 30.43,53.1 30.17,53.28 29.93,53.39 29.8,53.44 29.68,53.47 29.56,53.49 29.43,53.5 29.31,53.5 29.19,53.48 29.07,53.46 28.97,53.42 28.82,53.36 28.68,53.28 28.54,53.17 28.43,53.06 28.33,52.94 28.25,52.8 28.18,52.66 28.13,52.49 28.1,52.37 28.08,52.23 27.96,50.47 27.9,49.38 27.88,48.85 27.88,48.22 27.89,41.94 27.78,37.16 27.79,36.84 27.84,36.05 27.85,35.61 27.89,33.49 27.89,32.7 27.9,32.35 27.94,31.1 27.96,30.43 27.97,30.3 27.99,30.2 28.01,30.11 28.05,30.05 28.09,30 28.16,29.95 28.24,29.91 28.33,29.89 28.59,29.86 29.44,29.8 30.41,29.78 31.36,29.77 32.79,29.79 33.44,29.78 33.52,29.76 33.6,29.71 33.66,29.65 33.72,29.56 33.76,29.48 33.77,29.4 33.77,29.31 33.74,29.24 33.73,29.23 33.63,29.19 33.51,29.16 33.37,29.14 33.18,29.13 32.29,29.12 29.65,29.03 28.29,29 27.89,29.01 27.1,29.08 27.03,29.1 26.97,29.13 26.93,29.17 26.91,29.24 26.89,29.32 26.86,30.12 26.84,31.14 26.88,33.84 26.91,37.35 26.92,37.54 26.99,38.14 27.04,39.09 27.05,39.69 27.05,45.19 27.06,48.83 27.05,49.69 27.02,51.52 27.02,52.74 27.03,52.97 27.07,53.23 27.12,53.53 27.21,53.94 27.24,54.01 27.3,54.07 27.37,54.12 27.12,54.77 26.63,54.55 26.56,54.51 26.49,54.43 26.44,54.31 26.27,53.72 26.24,53.55 26.23,53.39 26.22,50.09 26.23,43.18 26.22,41.66 26.2,40.78 26.16,39.79 26.07,37.87 26,37.11 25.99,36.8 25.97,33.73 25.97,29.3 25.99,29.13 26.05,28.94 26.14,28.77 26.25,28.61 26.35,28.51 26.46,28.42 26.58,28.34 26.69,28.29 26.89,28.24 27.18,28.17 27.39,28.14 27.59,28.12 28.66,28.13 30.41,28.17 31.82,28.22 33.51,28.29 33.62,28.29 33.7,28.26 33.74,28.22 33.76,28.16 33.86,27.53 33.96,27.07 34.41,25.03 34.56,24.43 34.7,23.91 34.83,23.49 34.99,23.09 35.16,22.77 35.37,22.46 35.54,22.24 35.91,21.83 36.34,21.39 36.95,20.77 37.09,20.64 37.23,20.53 37.36,20.44 37.5,20.36 37.76,20.26 38,20.2 38.24,20.17 38.49,20.17 38.72,20.21 38.93,20.29 39.15,20.41 39.35,20.55 39.56,20.76 39.83,21.07 40.39,21.77 40.55,22 41.34,23.56 42.07,25.07 42.19,25.35 42.28,25.59 42.34,25.81 42.42,26.1 42.49,26.45 42.56,26.83 42.76,28.1 42.79,28.21 42.81,28.25 42.88,28.27 42.98,28.27 46.88,28.35 47.43,28.36 47.62,28.38 47.77,28.41 47.93,28.46 48.07,28.53 48.18,28.61 48.29,28.71 48.37,28.82 48.45,28.95 48.52,29.1 48.56,29.24 48.59,29.37 48.63,29.71 48.72,32.61 48.91,36.65 49.05,37.91 49.11,38.56 49.23,40.62 49.44,44.41 49.51,45.34 49.52,45.73 49.48,48.41
MISO  (via drill 0.35)
  Top 0.635: v53.23,44.23 53.6,44.6 53.6,46.6 54.23,47.23 59.73,47.23 62.17,44.79 62.17,38.22 60.91,36.96 IC1.6
  Bottom 0.635: IC1.6 59.06,36.96 58.13,36.03 58.13,32.52 56.84,31.23 28.43,31.23 26.23,33.43 26.23,36.39 25.39,37.23 20.81,37.23 19.81,36.23 19.81,27.81 R2.1 | ISP.P$1 49.25,42.14 51.29,44.18 53.18,44.18 v53.23,44.23
MOSI  (via drill 0.35)
  Top 0.635: v24.23,33.23 v24.23,40.23 24.23,53.73 27.46,56.96 R1.1
  Bottom 0.635: IC1.5 60.54,31.75 59.02,30.23 26.13,30.23 24.23,32.13 v24.23,33.23 | ISP.P$4 45.55,39.55 45.23,39.23 45.23,33.93 44.53,33.23 29.33,33.23 28.23,34.33 28.23,39.03 27.03,40.23 v24.23,40.23
N$1
  Bottom 0.635: S1.2 17.57,39.23 | 17.57,39.23 S1.1 | IC1.3 55.17,36.96 55.79,36.34 55.79,33.2 54.82,32.23 28.93,32.23 27.23,33.93 27.23,37.73 26.23,38.73 18.07,38.73 17.57,39.23
N$2
  Top 0.635: Q1.2 18.88,61.35 R1.2
N$3
  Bottom 0.635: Q2.2 15.11,18.88 R2.2
N$4
  Top 0.635: Q3.2 58.58,56.58 62.35,56.58 R3.2
N$8
  Top 0.635: Q4.2 57.58,15.11 R4.2
N$9
  Top 0.635: R4.1 50.83,21.29 50.83,38.41 51.92,39.5 IC1.2
N$10
  Top 0.635: R5.1 19.46,55.2 Q1.3
N$11
  Top 0.635: R6.1 27.46,20.46 26.46,21.46 23.26,21.46 Q2.3
N$12
  Top 0.635: R7.1 50.6,55.4 53.6,55.4 Q3.3
N$13
  Top 0.635: Q4.3 57.13,27.33 R8.1
N$14
  Top 0.635: LD9.K 13.42,59.31 15.67,57.06 15.67,51.32 17.04,49.95 17.04,45.99 19.36,43.67 19.36,31.36 17.31,29.31 17.31,25.65 15.21,23.55 15.21,20.48 12.23,17.5 12.23,3.81 11.73,3.31 LD10.K | LD11.K 61.51,59.31 57.36,63.46 R7.2
  Bottom 0.635: LD9.K 14.5,59.31 16.22,57.59 16.22,53.68 17.67,52.23 50.81,52.23 53.05,54.47 53.05,57.56 54.8,59.31 LD11.K | LD10.K 16.31,3.31 28.51,15.51 48.46,15.51 60.66,3.31 LD12.K
N$15  (via drill 0.35)
  Top 0.635: LD14.K 17.25,10.33 17.25,22.23 21.23,26.21 21.23,30.38 20.38,31.23 20.38,44.35 18.05,46.68 18.05,50.42 16.8,51.67 16.8,65.88 LD13.K | LD16.K 73.15,9.01 72.37,8.23 70.23,8.23 68.23,10.23 64.23,10.23 62.23,8.23 60.68,8.23 v60.66,8.21
  Bottom 0.635: LD13.K 21.23,66.23 33.23,54.23 43.32,54.23 57.59,68.5 71.96,68.5 73.15,67.31 LD15.K | LD16.K 73.15,16.31 68.46,21 R8.2 | LD14.K 20.52,10.23 27.15,16.86 49.55,16.86 58.21,8.2 v60.65,8.2 v60.66,8.21
N$19  (via drill 0.35)
  Top 0.635: LD6.K 10.23,21.1 16.02,26.89 16.02,49.45 14.61,50.86 14.61,56.49 13.47,57.63 8.83,57.63 8.23,58.23 8.23,62.23 10.23,64.23 10.23,68.23 8.23,70.23 8.23,72.23 9.15,73.15 LD5.K | v20.66,17.33 19.9,16.57 19.9,14.1 R6.2
  Bottom 0.635: LD8.K 66.15,17.23 54.75,17.23 50.79,21.19 25.2,21.19 21.34,17.33 v20.66,17.33 10.41,17.33 LD6.K | LD7.K 60.88,73.15 42.96,55.23 33.63,55.23 15.71,73.15 LD5.K
N$20
  Top 0.635: LD1.K 3.31,60.65 8.5,55.46 | LD2.K 3.31,16.28 14.87,27.84 14.87,49.09 8.5,55.46 | R5.2 8.5,55.46
  Bottom 0.635: LD4.K 59.31,11.59 55.65,15.25 53.85,15.25 50.93,18.17 25.72,18.17 23.23,15.68 15.28,15.68 12.15,12.55 4.63,12.55 3.31,11.23 LD2.K | LD1.K 3.31,67.31 4.56,68.56 8.9,68.56 17.51,59.95 21.72,59.95 28.44,53.23 49.43,53.23 51.54,55.34 51.54,57.9 54.32,60.68 57.46,60.68 59.31,62.53 LD3.K
RST
  Bottom 0.635: IC1.1 52.35,42.04 50.85,40.54 50.85,38.58 49.28,37.01 ISP.P$5
SCK  (via drill 0.35)
  Top 0.635: v52.23,46.23 52.17,46.29 52.17,47.76 53.41,49 R3.1
  Bottom 0.635: IC1.7 58.8,39.5 58.27,40.03 58.27,42.88 59.98,44.59 59.98,47.23 58.21,49 R3.1 | ISP.P$3 48.92,39.55 48,40.47 48,43.65 50.58,46.23 v52.23,46.23
VDD  (via drill 0.35)
  Top 0.635: IC1.8 56.92,42.04 | C1.1 55.46,43.5 56.92,42.04 | LD5.A LD13.A LD9.A | LD8.A 63.85,14.61 60.33,18.13 60.33,29.13 57.23,32.23 57.23,41.73 56.92,42.04 | v52.84,50.09 54.48,51.73 64.73,51.73 69.23,56.23 69.23,60.85 68.23,61.85 LD11.A | LD10.A LD2.A LD6.A | LD11.A LD15.A LD7.A LD3.A LD11.A
  Bottom 0.635: BAT.P 22.23,25.53 20.43,23.73 17.23,23.73 | 17.23,23.73 11.73,23.73 7.95,19.95 7.95,15.48 8.82,14.61 LD6.A | LD1.A 8.23,63.85 8.23,60.62 | LD9.A 9.46,61.85 8.23,60.62 | 17.23,23.73 15.23,25.73 15.23,42.01 | 8.23,60.62 8.23,56.23 15.23,49.23 15.23,42.01 | 15.23,42.01 24.45,51.23 51.7,51.23 v52.84,50.09 53.04,50.09 53.84,49.29 53.84,47.22 | 53.84,47.22 52.83,48.23 49.98,48.23 46.71,44.96 ISP.P$2 | C1.1 54.53,45.23 53.84,45.92 53.84,47.22 | LD14.A LD10.A | LD4.A LD8.A LD16.A LD12.A 66.23,6.07 62.07,10.23 LD4.A

### Text on the board
tPlace: MODE / ON/OFF
bPlace: RESISTANCE / SUPPORT / CLUB / 2024
bNames: 3.3V